# EAGLE design Poulailler (EAGLE 6.3)
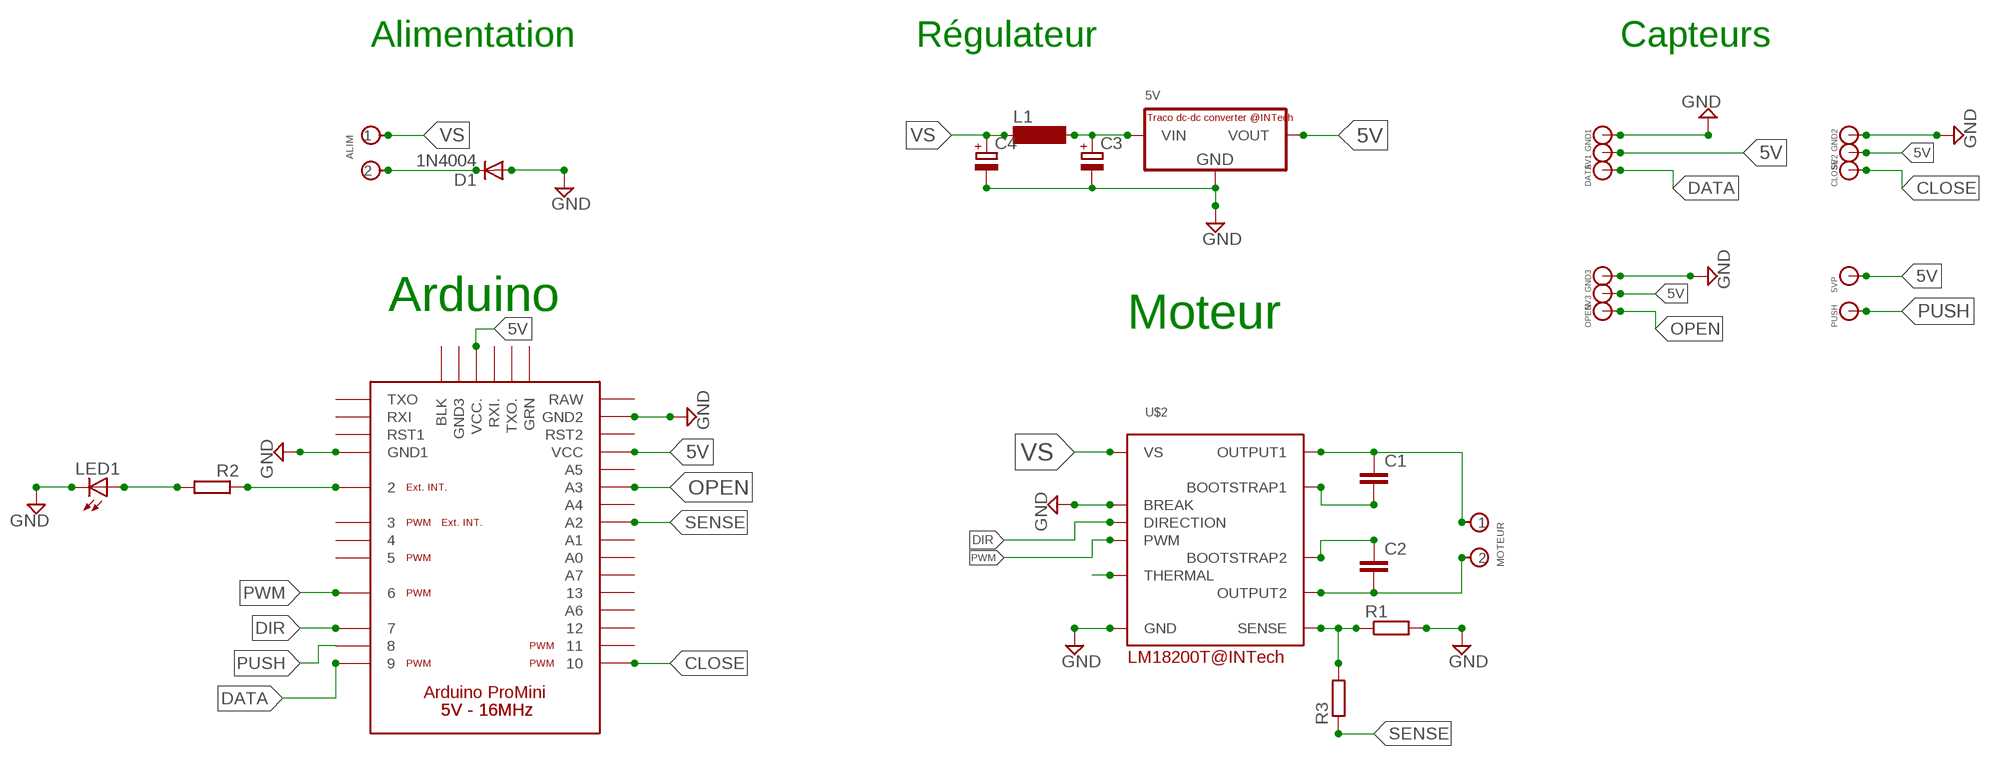
[diagram p0: schematic, sheet 1]

## Parts
5V  R-78C-1.0_INTECH  [SIP3_INTECH]
5V1  SOLPAD-1_CF_INTECH  [SOLPAD-1]
5V2  SOLPAD-1_CF_INTECH  [SOLPAD-1]
5V3  SOLPAD-1_CF_INTECH  [SOLPAD-1]
5VP  SOLPAD-1_CF_INTECH  [SOLPAD-1]
ALIM  BORNIER-2  [BORNIER-2]
C1  C-EU025-025X050  [C025-025X050]
C2  C-EU025-025X050  [C025-025X050]
C3  CPOL-EUE2,5-6E  [E2,5-6E]
C4  CPOL-EUE2,5-6E  [E2,5-6E]
CLOSE  SOLPAD-1_CF_INTECH  [SOLPAD-1]
D1  1N4004  [DO41-10]
DATA  SOLPAD-1_CF_INTECH  [SOLPAD-1]
GND1  SOLPAD-1_CF_INTECH  [SOLPAD-1]
GND2  SOLPAD-1_CF_INTECH  [SOLPAD-1]
GND3  SOLPAD-1_CF_INTECH  [SOLPAD-1]
L1  SD12-1000  [SD12_1000]
LED1  LED3MM  [LED3MM]
MOTEUR  BORNIER-2  [BORNIER-2]
OPEN  SOLPAD-1_CF_INTECH  [SOLPAD-1]
PUSH  SOLPAD-1_CF_INTECH  [SOLPAD-1]
R1  R-EU_0204/5  [0204/5]
R2  R-EU_0204/5  [0204/5]
R3  R-EU_0204/5  [0204/5]
U$1  ARDUINO_PRO_MINI  [ARDUINO_PRO_MINI]
U$2  LM18200T_CF_INTECH  [LM18200T_CF_INTECH]

## Nets
5V: 5V1.DATA 5V2.DATA 5V3.DATA 5V.VOUT 5VP.DATA U$1.VCC1(VCC) U$1.VCC2(VCC.)
CLOSE: CLOSE.DATA U$1.10
DATA: DATA.DATA U$1.9
DIR: U$1.7 U$2.3(DIRECTION)
GND: 5V.GND C3.- C4.- D1.A GND1.DATA GND2.DATA GND3.DATA LED1.K(C) R1.2 U$1.GND1 U$1.GND2 U$2.4(BREAK) U$2.7(GND)
N$1: ALIM.2 D1.C
N$2: R2.1 U$1.2
N$4: 5V.VIN C3.+ L1.2
N$5: C1.1 MOTEUR.1 U$2.2(OUTPUT1)
N$6: C1.2 U$2.1(BOOTSTRAP1)
N$7: C2.1 U$2.11(BOOTSTRAP2)
N$8: C2.2 MOTEUR.2 U$2.10(OUTPUT2)
N$9: LED1.A R2.2
N$10: U$2.9(THERMAL)
OPEN: OPEN.DATA U$1.A3
PUSH: PUSH.DATA U$1.8
PWM: U$1.6 U$2.5(PWM)
SENS: R1.1 R3.2 U$2.8(SENSE)
SENSE: R3.1 U$1.A2
VS: ALIM.1 C4.+ L1.1 U$2.6(VS)
Unconnected: U$1.3 U$1.4 U$1.5 U$1.11 U$1.12 U$1.13 U$1.A0 U$1.A1 U$1.A4 U$1.A5 U$1.A6 U$1.A7 U$1.BLK U$1.GND3 U$1.GRN U$1.RAW U$1.RST1 U$1.RST2 U$1.RXI1(RXI) U$1.RXI2(RXI.) U$1.TXO1(TXO) U$1.TXO2(TXO.)

## Notes on the sheet
- Alimentation | Régulateur | Capteurs
- Arduino
- Moteur

## Library data of the parts
5V = INTech:R-78C*-1.0_INTECH: Convertisseur dc-dc Traco
5V1-5V3 5VP CLOSE DATA GND1-GND3 OPEN PUSH = INTech:SOLPAD-1_CF_INTECH
ALIM MOTEUR = Bornier-2:BORNIER-2
C1 C2 = resistor:C-EU: CAPACITOR, European symbol
C3 C4 = resistor:CPOL-EU: POLARIZED CAPACITOR, European symbol
D1 = diode:1N4004: DIODE general purpose rectifier, 1 A
L1 = inductor-neosid:SD12: INDUCTOR nominal inductance; OC_FARNELL: unknown; OC_NEWARK: unknown
LED1 = led:LED: LED OSRAM: - CHIPLED LG R971, LG N971, LY N971, LG Q971, LY Q971, LO R971, LY R971 LH N974, LH R974 LS Q976, LO Q976, LY Q976 LO Q996 - Hyper CHIPLED LW Q18S LB Q993, LB Q99A, LB R99A - SideLED LS A670, LO A670, LY A670, LG A670, LP A670 LB A673, LV A673, LT A673, LW A673 LH A674 LY A675 LS A676, LA A676, LO A676, LY A676, LW A676 LS A679, LY A679, LG A679 - Hyper Micro SIDELED® LS Y876, LA Y876, LO Y876, LY Y876 LT Y87S - SmartLED LW L88C, LW L88S LB L89C, LB L89S, LG L890 LS L89K, LO L89K, LY L89K LS L896, LA L896, LO L896, LY L896 - TOPLED LS T670, LO T670, LY T670, LG T670, LP T670 LSG T670, LSP T670, LSY T670, LOP T670, LYG T670 LG T671, LOG T671, LSG T671 LB T673, LV T673, LT T673, LW T673 LH T674 LS T676, LA T676, LO T676, LY T676, LB T676, LH T676, LSB T676, LW T676 LB T67C, LV T67C, LT T67C, LS T67K, LO T67K, LY T67K, LW E67C LS E67B, LA E67B, LO E67B, LY E67B, LB E67C, LV E67C, LT E67C LW T67C LS T679, LY T679, LG T679 LS T770, LO T770, LY T770, LG T770, LP T770 LB T773, LV T773, LT T773, LW T773 LH T774 LS E675, LA E675, LY E675, LS T675 LS T776, LA T776, LO T776, LY T776, LB T776 LHGB T686 LT T68C, LB T68C - Hyper Mini TOPLED® LB M676 - Mini TOPLED Santana® LG M470 LS M47K, LO M47K, LY M47K Source: http://www.osram.convergy.de LUXEON: - LUMILED® LXK2-PW12-R00, LXK2-PW12-S00, LXK2-PW14-U00, LXK2-PW14-V00 LXK2-PM12-R00, LXK2-PM12-S00, LXK2-PM14-U00 LXK2-PE12-Q00, LXK2-PE12-R00, LXK2-PE12-S00, LXK2-PE14-T00, LXK2-PE14-U00 LXK2-PB12-K00, LXK2-PB12-L00, LXK2-PB12-M00, LXK2-PB14-N00, LXK2-PB14-P00, LXK2-PB14-Q00 LXK2-PR12-L00, LXK2-PR12-M00, LXK2-PR14-Q00, LXK2-PR14-R00 LXK2-PD12-Q00, LXK2-PD12-R00, LXK2-PD12-S00 LXK2-PH12-R00, LXK2-PH12-S00 LXK2-PL12-P00, LXK2-PL12-Q00, LXK2-PL12-R00 Source: www.luxeon.com KINGBRIGHT: KA-3528ASYC Source: www.kingbright.com
R1-R3 = resistor:R-EU_: RESISTOR, European symbol
U$1 = Arduino_Pro_Mini@S&G:ARDUINO_PRO_MINI: Aduino Pro Mini from sparkfun electronics 2015 © S&G Cie.
U$2 = INTech:LM18200T_CF_INTECH: Pont en H pour le contrôle de moteurs

## Board
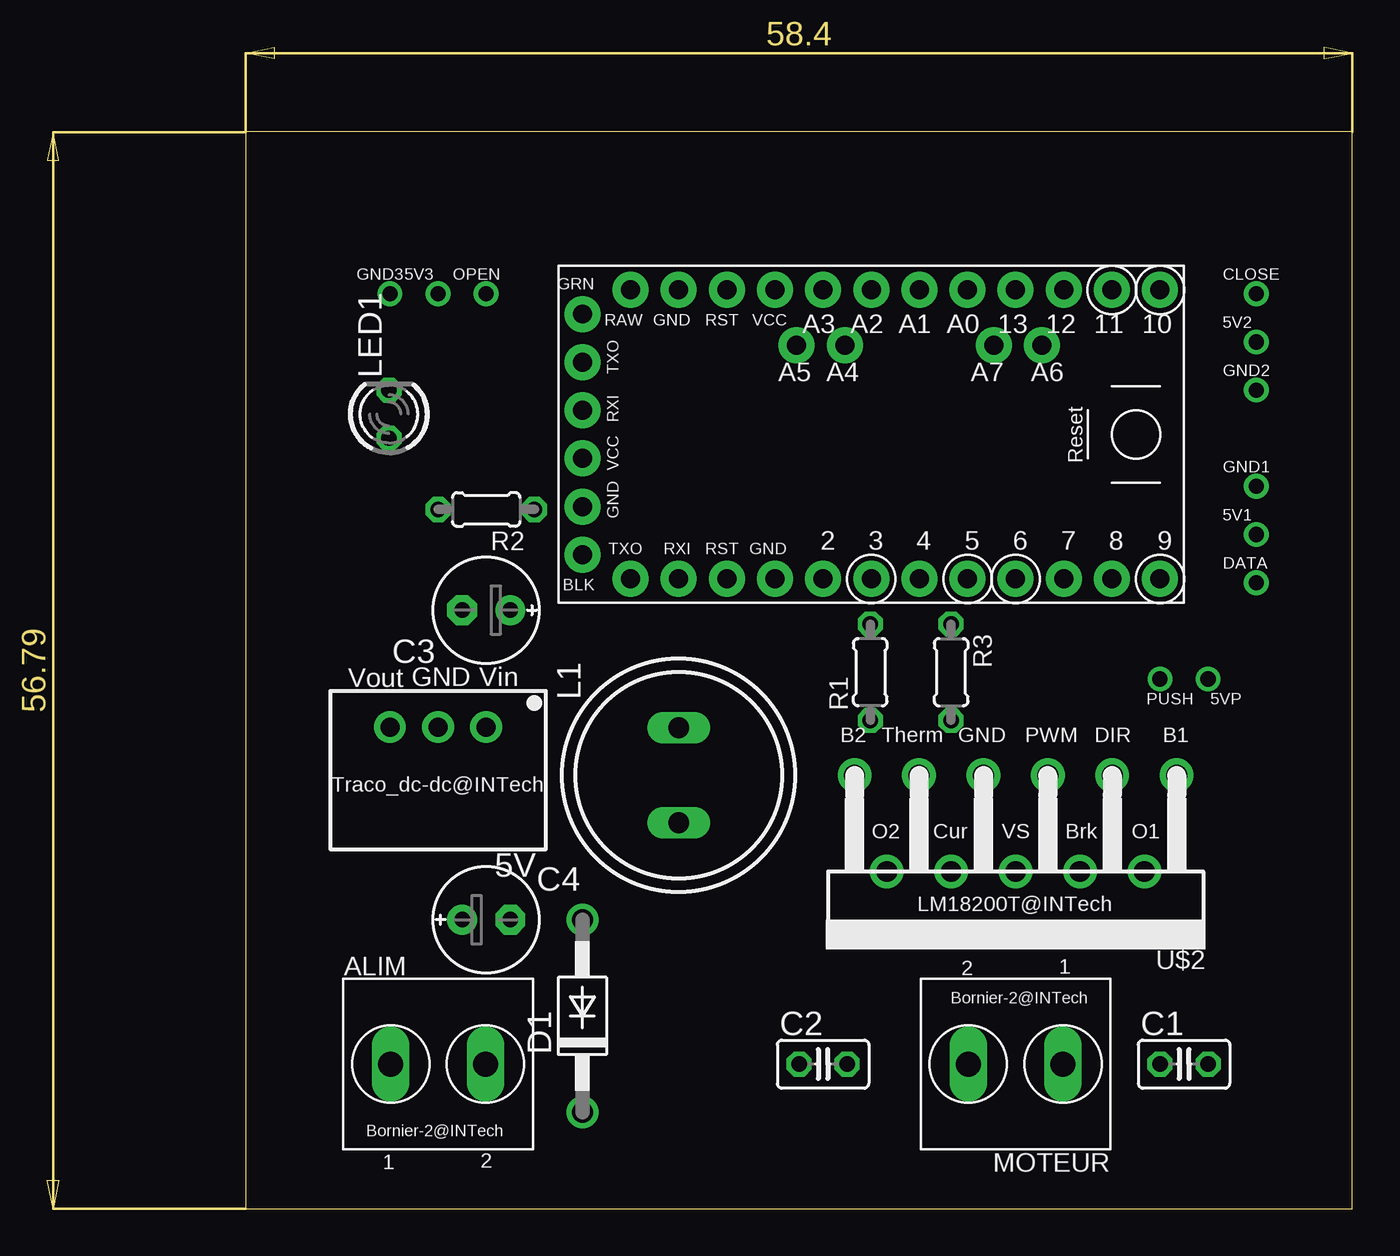
[diagram p1: board, top side]
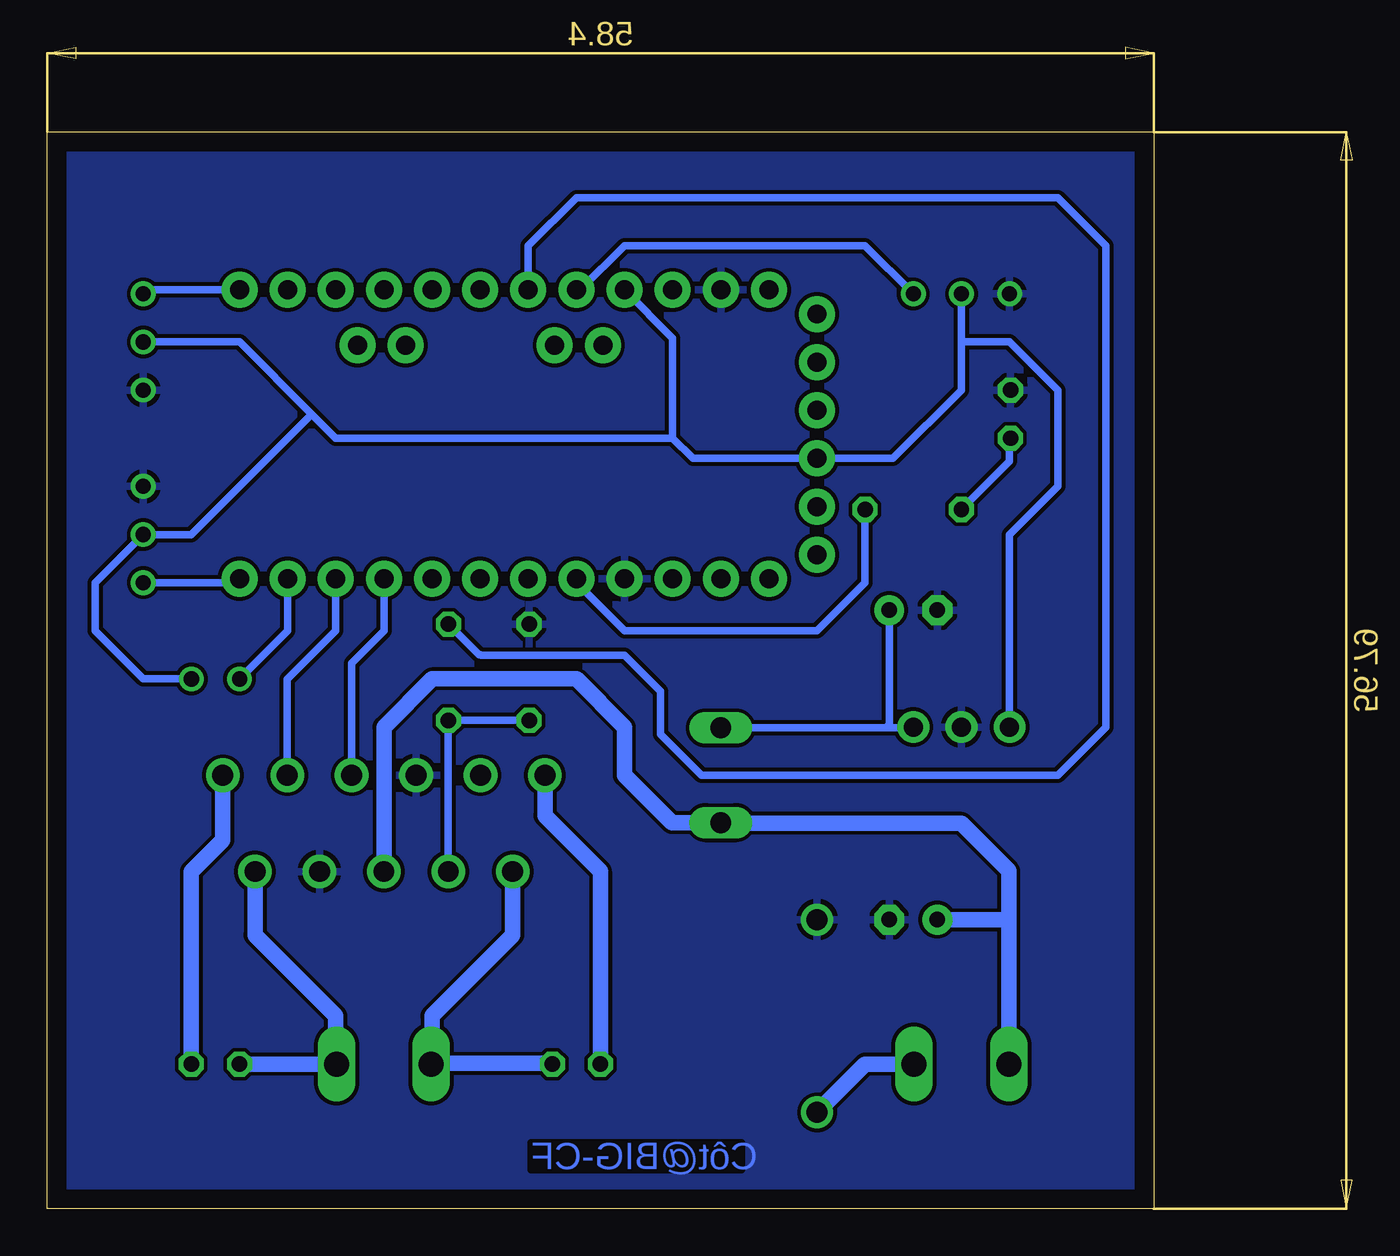
[diagram p2: board, bottom side, seen from below]

Size 58.4 x 56.82 mm. Coordinates in mm from the lower left corner, seen from the top.
Outline: 0,0 58.4,0 58.4,56.82 0,56.82 0,0
Copper layers (1*16): Top 0.035mm / dielectric 1.5mm / Bottom 0.035mm
Design rules "default": minimum track width 10mil, minimum drill 24mil, track to track 8mil, track to pad 8mil, pad to pad 8mil, via to via 8mil, smd to smd 8mil, copper to edge 40mil, drill to drill 8mil, minimum pad ring 10mil, minimum via ring 8mil, stop-mask expansion 4mil, vias tented up to drill 0mil, thermal gap 10mil

### Footprints (pad centres in the part's own frame; a part is rotated, then mirrored left to right if it is on the bottom)
SIP3_INTECH = drill 1 pad 1.676: GND 0,0; VIN -2.54,0; VOUT 2.54,0
SOLPAD-1 = drill 0.8: DATA 0,0
BORNIER-2 = drill 1.321 long: 1 -2.5,0; 2 2.5,0
C025-025X050 = drill 0.813 octagon: 1 -1.27,0; 2 1.27,0
E2,5-6E = drill 0.813 pad 1.575: + -1.27,0 | drill 0.813 pad 1.575 octagon: - 1.27,0
DO41-10 = drill 1.118: A 5.08,0; C -5.08,0
SD12_1000 = drill 1.1 long: 1 -2.5,0; 2 2.5,0
LED3MM = drill 0.813 octagon: A -1.27,0; K 1.27,0
0204/5 = drill 0.813 octagon: 1 -2.54,0; 2 2.54,0
ARDUINO_PRO_MINI = drill 1 pad 1.9: 2 -7.62,2.54; 3 -7.62,0; 4 -7.62,-2.54; 5 -7.62,-5.08; 6 -7.62,-7.62; 7 -7.62,-10.16; 8 -7.62,-12.7; 9 -7.62,-15.24; 10 7.62,-15.24; 11 7.62,-12.7; 12 7.62,-10.16; 13 7.62,-7.62; A0 7.62,-5.08; A1 7.62,-2.54; A2 7.62,0; A3 7.62,2.54; A4 4.699,1.397; A5 4.699,3.937; A6 4.699,-9.017; A7 4.699,-6.477; BLK -6.35,15.24; GND1 -7.62,5.08; GND2 7.62,10.16; GND3 -3.81,15.24; GRN 6.35,15.24; RAW 7.62,12.7; RST1 -7.62,7.62; RST2 7.62,7.62; RXI1 -7.62,10.16; RXI2 1.27,15.24; TXO1 -7.62,12.7; TXO2 3.81,15.24; VCC1 7.62,5.08; VCC2 -1.27,15.24
LM18200T_CF_INTECH = drill 1.1 pad 1.778: 1 -8.5,-8.89; 2 -6.8,-3.81; 3 -5.1,-8.89; 4 -3.4,-3.81; 5 -1.7,-8.89; 6 0,-3.81; 7 1.7,-8.89; 8 3.4,-3.81; 9 5.1,-8.89; 10 6.8,-3.81; 11 8.5,-8.89

### Placement (x,y rotation side)
5V  10.16,25.4 180 top
5V1  53.34,35.56 0 top
5V2  53.34,45.72 0 top
5V3  10.16,48.26 0 top
5VP  50.8,27.94 180 top
ALIM  10.16,7.62 0 top
C1  49.53,7.62 0 top
C2  30.48,7.62 0 top
C3  12.7,31.57 180 top
C4  12.7,15.24 0 top
CLOSE  53.34,48.26 0 top
D1  17.78,10.16 90 top
DATA  53.34,33.02 0 top
GND1  53.34,38.1 0 top
GND2  53.34,43.18 0 top
GND3  7.62,48.26 0 top
L1  22.86,22.86 90 top
LED1  7.57,41.91 90 top
MOTEUR  40.64,7.62 180 top
OPEN  12.7,48.26 0 top
PUSH  48.26,27.94 180 top
R1  32.97,28.3 90 top
R2  12.7,36.88 180 top
R3  37.24,28.3 270 top
U$1  33.02,40.84 90 top
U$2  40.64,13.97 180 top

### Tracks (layer width: path | path; a pad name or v marks a point on that pad's centre or on a via)
5V
  Bottom 0.406: 5V3.DATA 10.16,45.72 | 25.4,40.64 24.33,39.57 U$1.VCC2 13.77,39.57 10.16,43.18 10.16,45.72 | 25.4,40.64 25.4,45.92 U$1.VCC1 | 5V2.DATA 48.26,45.72 44.45,41.91 | 44.45,41.91 43.18,40.64 25.4,40.64 | 44.45,41.91 50.8,35.56 5V1.DATA 55.88,33.02 55.88,30.48 53.34,27.94 5VP.DATA | 5V.VOUT 7.62,35.56 5.08,38.1 5.08,43.18 7.62,45.72 10.16,45.72
CLOSE
  Bottom 0.406: U$1.10 53.34,48.46 CLOSE.DATA
DATA
  Bottom 0.406: DATA.DATA 48.46,33.02 U$1.9
DIR
  Bottom 0.406: U$2.3 45.74,27.92 43.18,30.48 U$1.7
GND
  pour Bottom: 0,55.88 58.42,55.88 58.42,0 0,0
N$1
  Bottom 0.813: ALIM.2 15.24,7.62 D1.C
N$2
  Bottom 0.406: R2.1 15.24,33.02 17.78,30.48 27.94,30.48 30.48,33.02 U$1.2
N$4
  Bottom 0.406: L1.2 14.15,25.36 | 14.15,25.36 12.74,25.36 5V.VIN | 14.15,25.36 13.97,25.54 C3.+
N$5
  Bottom 0.813: U$2.2 47.44,14.42 43.18,10.16 43.18,7.66 MOTEUR.1 C1.1
N$6
  Bottom 0.813: U$2.1 49.14,19.44 50.8,17.78 C1.2
N$7
  Bottom 0.813: U$2.11 32.14,20.73 29.21,17.8 C2.1
N$8
  Bottom 0.813: U$2.10 33.84,14.42 38.1,10.16 38.1,7.66 | 38.1,7.66 MOTEUR.2 | 38.1,7.66 31.79,7.66 C2.2
N$9
  Bottom 0.406: LED1.A 7.62,40.64 7.62,39.42 R2.2
OPEN
  Bottom 0.406: U$1.A3 30.28,48.46 27.94,50.8 15.24,50.8 OPEN.DATA
PUSH
  Bottom 0.406: PUSH.DATA 45.72,30.48 U$1.8
PWM
  Bottom 0.406: U$1.6 40.64,30.48 42.34,28.78 U$2.5
SENS
  Bottom 0.406: U$2.8 R3.2 R1.1
SENSE
  Bottom 0.406: R3.1 35.61,29.21 35.54,29.21 35.51,29.18 27.94,29.18 26.03,27.28 26.03,25.02 23.88,22.86 5.08,22.86 2.54,25.4 2.54,50.8 5.08,53.34 30.48,53.34 33.02,50.8 U$1.A2
VS
  Bottom 0.813: ALIM.1 7.66,15.24 | 7.66,15.24 7.66,17.82 10.16,20.32 22.82,20.32 L1.1 25.44,20.36 27.94,22.86 27.94,25.4 30.48,27.94 38.1,27.94 40.64,25.4 U$2.6 | C4.+ 7.66,15.24

### Text on the board
Bottom: Côt@BIG-CF